# Altium schematic sheet FOC功率.SchDoc
size A4
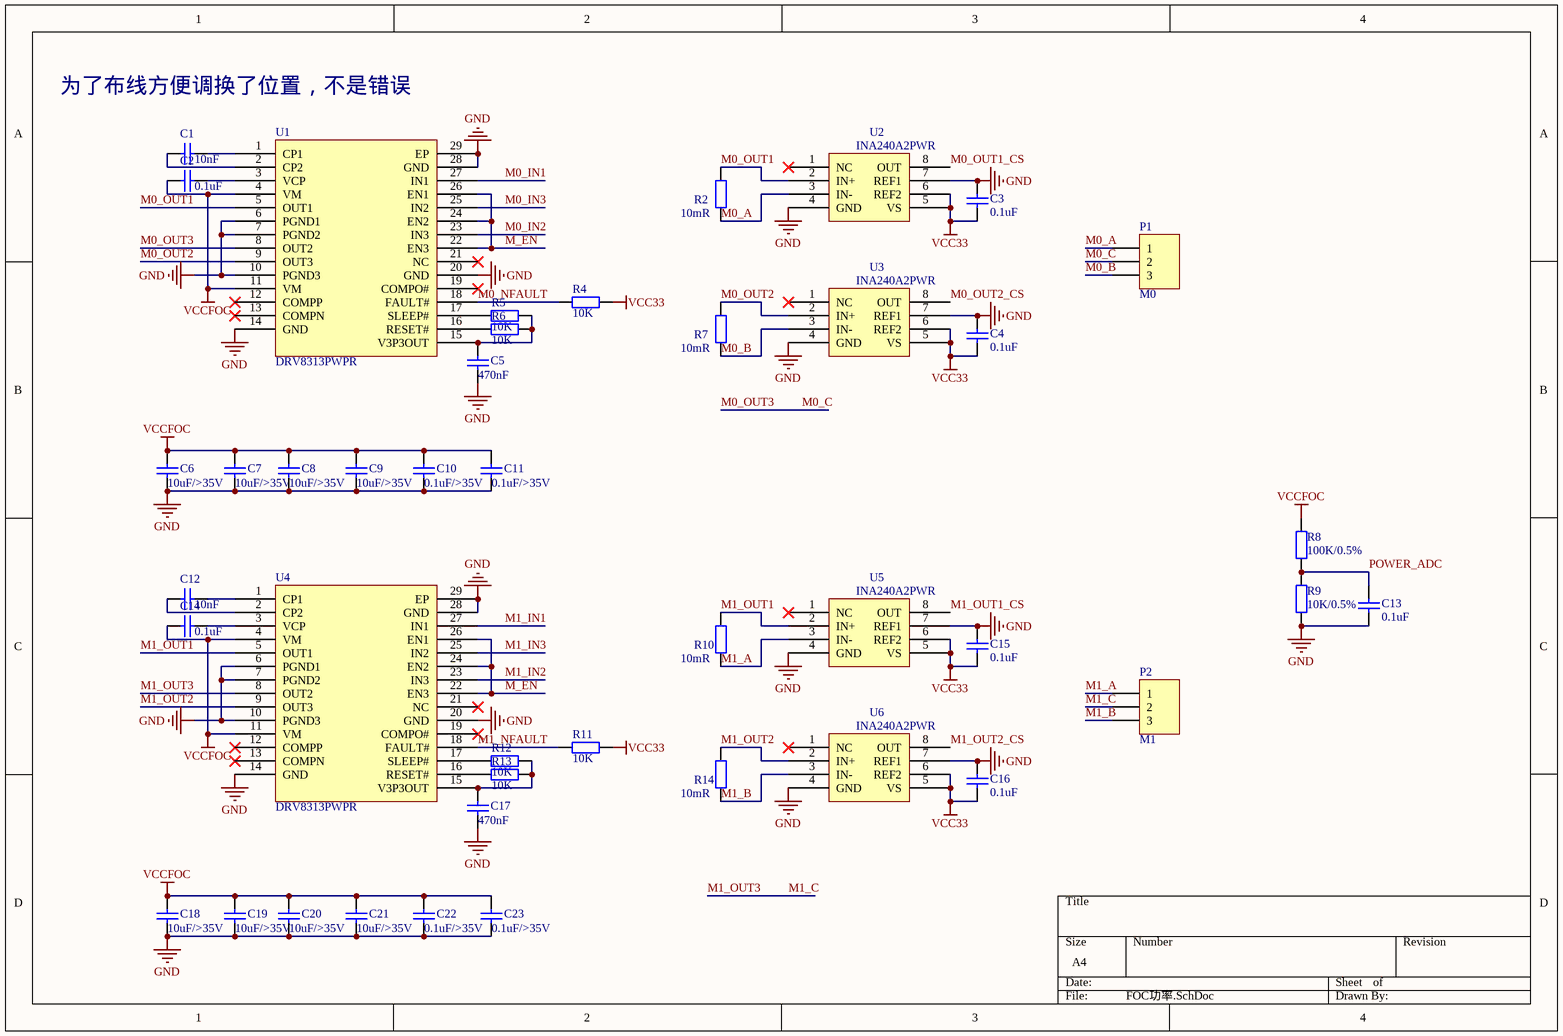
[diagram p0: FOC功率.SchDoc]

## Parts
C1  10nF  [C0805_M]
C2  0.1uF  [C0805_M]
C3  0.1uF  [C0805_M]
C4  0.1uF  [C0805_M]
C5  470nF  [C0805_M]
C6  10uF/>35V  [C0805_M]
C7  10uF/>35V  [C0805_M]
C8  10uF/>35V  [C0805_M]
C9  10uF/>35V  [C0805_M]
C10  0.1uF/>35V  [C0805_M]
C11  0.1uF/>35V  [C0805_M]
C12  10nF  [C0805_M]
C13  0.1uF  [C0805_M]
C14  0.1uF  [C0805_M]
C15  0.1uF  [C0805_M]
C16  0.1uF  [C0805_M]
C17  470nF  [C0805_M]
C18  10uF/>35V  [C0805_M]
C19  10uF/>35V  [C0805_M]
C20  10uF/>35V  [C0805_M]
C21  10uF/>35V  [C0805_M]
C22  0.1uF/>35V  [C0805_M]
C23  0.1uF/>35V  [C0805_M]
P1  M0  [MR30PB-F]
P2  M1  [MR30PB-F]
R2  10mR  [R1206_M]
R4  10K  [R0805_M]
R5  10K  [R0805_M]
R6  10K  [R0805_M]
R7  10mR  [R1206_M]
R8  100K/0.5%  [R0805_M]
R9  10K/0.5%  [R0805_M]
R10  10mR  [R1206_M]
R11  10K  [R0805_M]
R12  10K  [R0805_M]
R13  10K  [R0805_M]
R14  10mR  [R1206_M]
U1  DRV8313PWPR  [TSSOP28-PowerPad]
U2  INA240A2PWR  [TSSOP8]
U3  INA240A2PWR  [TSSOP8]
U4  DRV8313PWPR  [TSSOP28-PowerPad]
U5  INA240A2PWR  [TSSOP8]
U6  INA240A2PWR  [TSSOP8]

## Nets
GND: C3.2 C4.2 C5.1 C6.1 C7.1 C8.1 C9.1 C10.1 C11.1 C13.1 C15.2 C16.2 C17.1 C18.1 C19.1 C20.1 C21.1 C22.1 C23.1 R9.2 U1.6(PGND1) U1.7(PGND2) U1.10(PGND3) U1.14(GND) U1.20(GND) U1.28(GND) U1.29(EP) U2.4(GND) U2.7(REF1) U3.4(GND) U3.7(REF1) U4.6(PGND1) U4.7(PGND2) U4.10(PGND3) U4.14(GND) U4.20(GND) U4.28(GND) U4.29(EP) U5.4(GND) U5.7(REF1) U6.4(GND) U6.7(REF1)
VCC33: C3.1 C4.1 C15.1 C16.1 R4.2 R11.2 U2.5(VS) U2.6(REF2) U3.5(VS) U3.6(REF2) U5.5(VS) U5.6(REF2) U6.5(VS) U6.6(REF2)
VCCFOC: C2.1 C6.2 C7.2 C8.2 C9.2 C10.2 C11.2 C14.1 C18.2 C19.2 C20.2 C21.2 C22.2 C23.2 R8.1 U1.4(VM) U1.11(VM) U4.4(VM) U4.11(VM)
M0_A: P1.1 R2.1 U2.3(IN-)
M0_B: P1.3 R7.1 U3.3(IN-)
M0_C: P1.2 U1.8(OUT2)  [also labelled M0_OUT3]
M0_IN1: U1.27(IN1)
M0_IN2: U1.23(IN3)
M0_IN3: U1.25(IN2)
M0_NFAULT: R4.1 U1.18(FAULT#)
M0_OUT1: R2.2 U1.5(OUT1) U2.2(IN+)
M0_OUT1_CS: U2.8(OUT)
M0_OUT2: R7.2 U1.9(OUT3) U3.2(IN+)
M0_OUT2_CS: U3.8(OUT)
M1_A: P2.1 R10.1 U5.3(IN-)
M1_B: P2.3 R14.1 U6.3(IN-)
M1_C: P2.2 U4.8(OUT2)  [also labelled M1_OUT3]
M1_IN1: U4.27(IN1)
M1_IN2: U4.23(IN3)
M1_IN3: U4.25(IN2)
M1_NFAULT: R11.1 U4.18(FAULT#)
M1_OUT1: R10.2 U4.5(OUT1) U5.2(IN+)
M1_OUT1_CS: U5.8(OUT)
M1_OUT2: R14.2 U4.9(OUT3) U6.2(IN+)
M1_OUT2_CS: U6.8(OUT)
M_EN: U1.22(EN3) U1.24(EN2) U1.26(EN1) U4.22(EN3) U4.24(EN2) U4.26(EN1)
POWER_ADC: C13.2 R8.2 R9.1
NetC1_1: C1.1 U1.2(CP2)
NetC1_2: C1.2 U1.1(CP1)
NetC2_2: C2.2 U1.3(VCP)
NetC5_2: C5.2 R5.2 R6.2 U1.15(V3P3OUT)
NetC12_1: C12.1 U4.2(CP2)
NetC12_2: C12.2 U4.1(CP1)
NetC14_2: C14.2 U4.3(VCP)
NetC17_2: C17.2 R12.2 R13.2 U4.15(V3P3OUT)
NetR5_1: R5.1 U1.17(SLEEP#)
NetR6_1: R6.1 U1.16(RESET#)
NetR12_1: R12.1 U4.17(SLEEP#)
NetR13_1: R13.1 U4.16(RESET#)

Not connected (* = marked no-connect by the designer): U1 12(COMPP)* 13(COMPN)* 19(COMPO#)* 21(NC)*; U2 1(NC)*; U3 1(NC)*; U4 12(COMPP)* 13(COMPN)* 19(COMPO#)* 21(NC)*; U5 1(NC)*; U6 1(NC)*

## Notes on the sheet
- 为了布线方便调换了位置，不是错误

## Library data of the parts
C1-C23 = Cap: Capacitor; Published: 8-Jun-2000; LatestRevisionDate: 17-Jul-2002; LatestRevisionNote: Re-released for DXP Platform.; PackageReference: RAD-0.3; Publisher: Altium Limited; PackageDescription: Radial Cap, Thru-Hole; 2 Leads; 0.3 in Pin Spacing
P1 P2 = Header 3: Header, 3-Pin; LatestRevisionDate: 17-Jul-2002; LatestRevisionNote: Re-released for DXP Platform.; Publisher: Altium Limited
R2 R7 R10 R14 = Res2: Resistor; Published: 8-Jun-2000; LatestRevisionDate: 17-Jul-2002; LatestRevisionNote: Re-released for DXP Platform.; PackageReference: AXIAL-0.4; Publisher: Altium Limited; PackageDescription: Axial Device, Thru-Hole; 2 Leads; 0.4 in Pin Spacing
R4-R6 R8 R9 R11-R13 = Res2: Resistor; Value: 1K; Published: 8-Jun-2000; LatestRevisionDate: 17-Jul-2002; LatestRevisionNote: Re-released for DXP Platform.; PackageReference: AXIAL-0.4; Publisher: Altium Limited; PackageDescription: Axial Device, Thru-Hole; 2 Leads; 0.4 in Pin Spacing
U2 U3 U5 U6 = Component_3